# Altium schematic sheet Ethernet.SchDoc
size A3
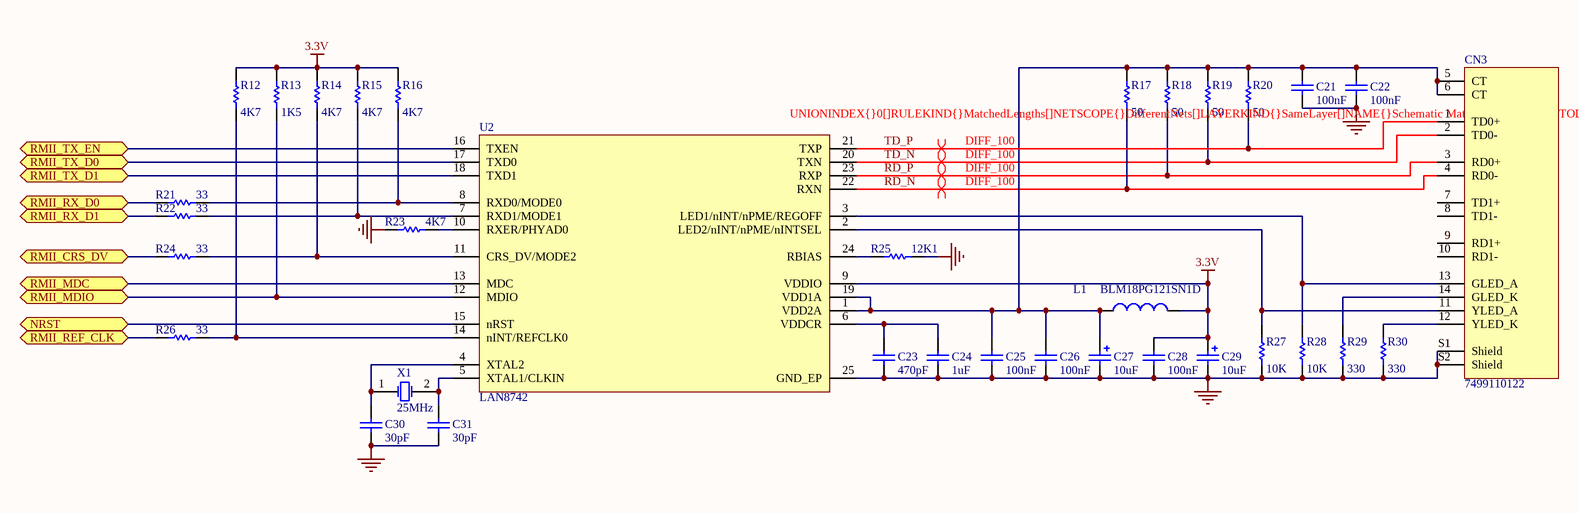
[diagram p0: Ethernet.SchDoc]

## Parts
C21  value 100nF  [CAPC2012N]  (hidden comment: Cap)
C22  value 100nF  [CAPC2012N]  (hidden comment: Cap)
C23  value 470pF  [CAPC2012N]  (hidden comment: Cap)
C24  value 1uF  [CAPC3216N]  (hidden comment: Cap)
C25  value 100nF  [CAPC2012N]  (hidden comment: Cap)
C26  value 100nF  [CAPC2012N]  (hidden comment: Cap)
C27  value 10uF  [TC3216-1206]  (hidden comment: Cap Pol)
C28  value 100nF  [CAPC2012N]  (hidden comment: Cap)
C29  value 10uF  [TC3216-1206]  (hidden comment: Cap Pol)
C30  value 30pF  [CAPC2012N]  (hidden comment: Cap)
C31  value 30pF  [CAPC2012N]  (hidden comment: Cap)
CN3  7499110122  [7499110122]
L1  value BLM18PG121SN1D  [INDC2012N]  (hidden comment: Inductor)
R12  value 4K7  [RESC2012N]  (hidden comment: 1206)
R13  value 1K5  [RESC2012N]  (hidden comment: 1206)
R14  value 4K7  [RESC2012N]  (hidden comment: 1206)
R15  value 4K7  [RESC2012N]  (hidden comment: 1206)
R16  value 4K7  [RESC2012N]  (hidden comment: 1206)
R17  value 50  [RESC2012N]  (hidden comment: 1206)
R18  value 50  [RESC2012N]  (hidden comment: 1206)
R19  value 50  [RESC2012N]  (hidden comment: 1206)
R20  value 50  [RESC2012N]  (hidden comment: 1206)
R21  value 33  [RESC2012N]  (hidden comment: 1206)
R22  value 33  [RESC2012N]  (hidden comment: 1206)
R23  value 4K7  [RESC2012N]  (hidden comment: 1206)
R24  value 33  [RESC2012N]  (hidden comment: 1206)
R25  value 12K1  [RESC2012N]  (hidden comment: 1206)
R26  value 33  [RESC2012N]  (hidden comment: 1206)
R27  value 10K  [RESC2012N]  (hidden comment: 1206)
R28  value 10K  [RESC2012N]  (hidden comment: 1206)
R29  value 330  [RESC2012N]  (hidden comment: 1206)
R30  value 330  [RESC2012N]  (hidden comment: 1206)
U2  LAN8742  [QFN50P400X400X100-24M]
X1  25MHz  [QC5CB]

## Ports
NRST (bidir), RMII_CRS_DV (bidir), RMII_MDC (bidir), RMII_MDIO (bidir), RMII_REF_CLK (bidir), RMII_RX_D0 (bidir), RMII_RX_D1 (bidir), RMII_TX_D0 (bidir), RMII_TX_D1 (bidir), RMII_TX_EN (bidir)

## Nets
3.3V: C28.2 C29.1 L1.2 R12.2 R13.2 R14.2 R15.2 R16.2 U2.9(VDDIO)
DGND: C21.1 C22.1 C23.1 C24.1 C25.1 C26.1 C27.2 C28.1 C29.2 C30.1 C31.1 CN3.S1(Shield) CN3.S2(Shield) R23.2 R25.1 R27.1 R28.1 R29.1 R30.1 U2.25(GND_EP)
NRST: U2.15(nRST) ; port NRST
RD_N: CN3.4(RD0-) R17.1 U2.22(RXN)
RD_P: CN3.3(RD0+) R18.1 U2.23(RXP)
RMII_CRS_DV: R24.2 ; port RMII_CRS_DV
RMII_MDC: U2.13(MDC) ; port RMII_MDC
RMII_MDIO: R13.1 U2.12(MDIO) ; port RMII_MDIO
RMII_REF_CLK: R26.2 ; port RMII_REF_CLK
RMII_RX_D0: R21.2 ; port RMII_RX_D0
RMII_RX_D1: R22.2 ; port RMII_RX_D1
RMII_TX_D0: U2.17(TXD0) ; port RMII_TX_D0
RMII_TX_D1: U2.18(TXD1) ; port RMII_TX_D1
RMII_TX_EN: U2.16(TXEN) ; port RMII_TX_EN
TD_N: CN3.2(TD0-) R19.1 U2.20(TXN)
TD_P: CN3.1(TD0+) R20.1 U2.21(TXP)
NetC21_2: C21.2 C22.2 C25.2 C26.2 C27.1 CN3.5(CT) CN3.6(CT) L1.1 R17.2 R18.2 R19.2 R20.2 U2.1(VDD2A) U2.19(VDD1A)
NetC23_2: C23.2 C24.2 U2.6(VDDCR)
NetC30_2: C30.2 U2.4(XTAL2) X1.1(OSC1)
NetC31_2: C31.2 U2.5(XTAL1/CLKIN) X1.2(OSC2)
NetCN3_11: CN3.11(YLED_A) R27.2 U2.2(LED2/nINT/nPME/nINTSEL)
NetCN3_12: CN3.12(YLED_K) R30.2
NetCN3_13: CN3.13(GLED_A) R28.2 U2.3(LED1/nINT/nPME/REGOFF)
NetCN3_14: CN3.14(GLED_K) R29.2
NetR12_1: R12.1 R26.1 U2.14(nINT/REFCLK0)
NetR14_1: R14.1 R24.1 U2.11(CRS_DV/MODE2)
NetR15_1: R15.1 R22.1 U2.7(RXD1/MODE1)
NetR16_1: R16.1 R21.1 U2.8(RXD0/MODE0)
NetR23_1: R23.1 U2.10(RXER/PHYAD0)
NetR25_2: R25.2 U2.24(RBIAS)

Not connected (* = marked no-connect by the designer): CN3 7(TD1+) 8(TD1-) 9(RD1+) 10(RD1-)

## Layout directives
differential pair; net class DIFF_100; rule Matched Net Lengths [Tolerance = 100mil]: RD_N, RD_P, TD_N, TD_P

## Library data of the parts
C21-C26 C28 C30 C31 = Cap: Capacitor
C27 C29 = Cap Pol: Polarized Capacitor
CN3 = 7499110122: LAN-Transformer WE-RJ45LAN 10/100/1000 BaseT
R12-R30 = Res: Resistor
U2 = LAN8742: Small Footprint RMII 10/100 Ethernet Transceiver with HP Auto-MDIX and flexPWR Technology
X1 = XTAL: Crystal Oscillator